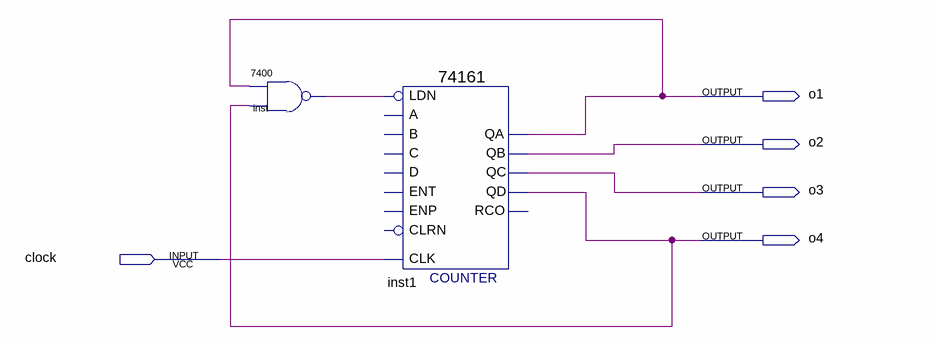
[diagram p0: schematic sheet]
// Quartus schematic test.bdf as structural Verilog: 2 symbols, 5 pins
module test (
  input  clock,
  output o1,
  output o2,
  output o3,
  output o4
);

  wire inst_1;

  \7400  inst (.\3 (o4), .\2 (o1), .\1 (inst_1));
  \74161  inst1 (
    .CLK(clock), .LDN(inst_1), .QD(o4), .QC(o3), .QB(o2), .QA(o1));  // open: CLRN, ENP, A, D, ENT, B, C, RCO
endmodule
